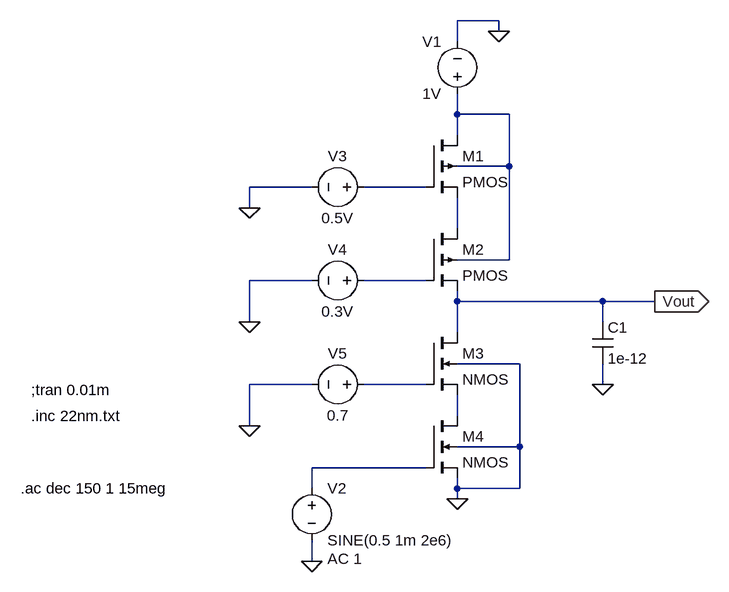
[diagram p0: schematic 22nm3rd.asc]
22nm3rd.asc, the LTspice schematic file:
Version 4
SHEET 1 880 680
WIRE 352 -464 288 -464
WIRE 352 -448 352 -464
WIRE 288 -432 288 -464
WIRE 288 -320 288 -352
WIRE 368 -320 288 -320
WIRE 288 -288 288 -320
WIRE 368 -240 368 -320
WIRE 368 -240 288 -240
WIRE 64 -208 -32 -208
WIRE 240 -208 144 -208
WIRE -32 -176 -32 -208
WIRE 288 -144 288 -192
WIRE 368 -96 368 -240
WIRE 368 -96 288 -96
WIRE 64 -64 -32 -64
WIRE 240 -64 144 -64
WIRE 288 -32 288 -48
WIRE 512 -32 288 -32
WIRE 592 -32 512 -32
WIRE -32 0 -32 -64
WIRE 512 0 512 -32
WIRE 288 16 288 -32
WIRE 384 64 288 64
WIRE 64 96 -32 96
WIRE 240 96 144 96
WIRE 512 96 512 64
WIRE 288 144 288 112
WIRE -32 160 -32 96
WIRE 384 192 384 64
WIRE 384 192 288 192
WIRE 240 224 64 224
WIRE 64 256 64 224
WIRE 288 256 288 240
WIRE 384 256 384 192
WIRE 384 256 288 256
WIRE 288 272 288 256
WIRE 64 368 64 336
FLAG 352 -448 0
FLAG 64 368 0
FLAG 512 96 0
FLAG 288 272 0
FLAG -32 -176 0
FLAG -32 0 0
FLAG -32 160 0
FLAG 592 -32 Vout
IOPIN 592 -32 Out
SYMBOL voltage 288 -336 R180
WINDOW 0 24 96 Left 2
WINDOW 3 24 16 Left 2
WINDOW 123 0 0 Left 0
WINDOW 39 0 0 Left 0
SYMATTR InstName V1
SYMATTR Value 1V
SYMBOL pmos4 240 -288 R0
SYMATTR InstName M1
SYMATTR Value2 l=22n w=500n
SYMBOL pmos4 240 -144 R0
SYMATTR InstName M2
SYMATTR Value2 l=22n w=500n
SYMBOL nmos4 240 16 R0
SYMATTR InstName M3
SYMATTR Value2 l=22n w=275n
SYMBOL nmos4 240 144 R0
SYMATTR InstName M4
SYMATTR Value2 l=22n w=275n
SYMBOL voltage 64 240 R0
WINDOW 123 24 124 Left 2
WINDOW 39 0 0 Left 0
SYMATTR Value2 AC 1
SYMATTR InstName V2
SYMATTR Value SINE(0.5 1m 2e6)
SYMBOL cap 496 0 R0
SYMATTR InstName C1
SYMATTR Value 1e-12
SYMBOL voltage 160 -208 R90
WINDOW 0 -32 56 VBottom 2
WINDOW 3 32 56 VTop 2
WINDOW 123 0 0 Left 0
WINDOW 39 0 0 Left 0
SYMATTR InstName V3
SYMATTR Value 0.5V
SYMBOL voltage 160 -64 R90
WINDOW 0 -32 56 VBottom 2
WINDOW 3 32 56 VTop 2
WINDOW 123 0 0 Left 0
WINDOW 39 0 0 Left 0
SYMATTR InstName V4
SYMATTR Value 0.3V
SYMBOL voltage 160 96 R90
WINDOW 0 -32 56 VBottom 2
WINDOW 3 32 56 VTop 2
WINDOW 123 0 0 Left 0
WINDOW 39 0 0 Left 0
SYMATTR InstName V5
SYMATTR Value 0.7
TEXT -368 104 Left 2 !;tran 0.01m
TEXT -368 144 Left 2 !.inc 22nm.txt
TEXT -384 256 Left 2 !.ac dec 150 1 15meg

The netlist it stands for:
* 22nm3rd.asc
V1 N001 0 1V
M1 N001 N002 N003 N001 PMOS l=22n w=500n
M2 N003 N004 Vout N001 PMOS l=22n w=500n
M3 Vout N005 N006 0 NMOS l=22n w=275n
M4 N006 N007 0 0 NMOS l=22n w=275n
V2 N007 0 SINE(0.5 1m 2e6) AC 1
C1 Vout 0 1e-12
V3 N002 0 0.5V
V4 N004 0 0.3V
V5 N005 0 0.7
.model NMOS NMOS
.model PMOS PMOS
.lib standard.mos
;tran 0.01m
.inc 22nm.txt
.ac dec 150 1 15meg
.backanno
.end